# EAGLE schematic jb-main (EAGLE 4.15)

## Sheet 1 of 4
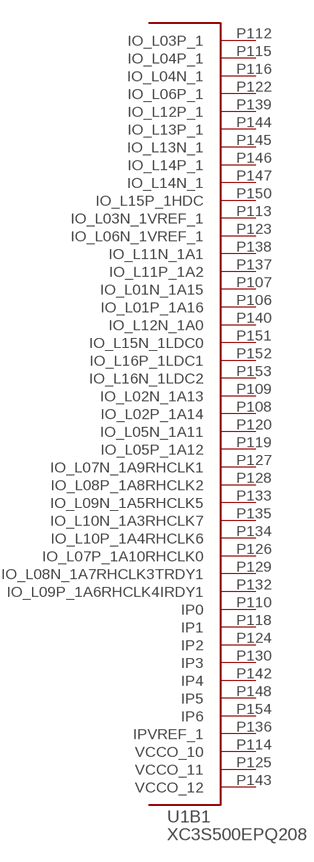
[diagram p0: schematic, sheet 1, part 1 of 2]
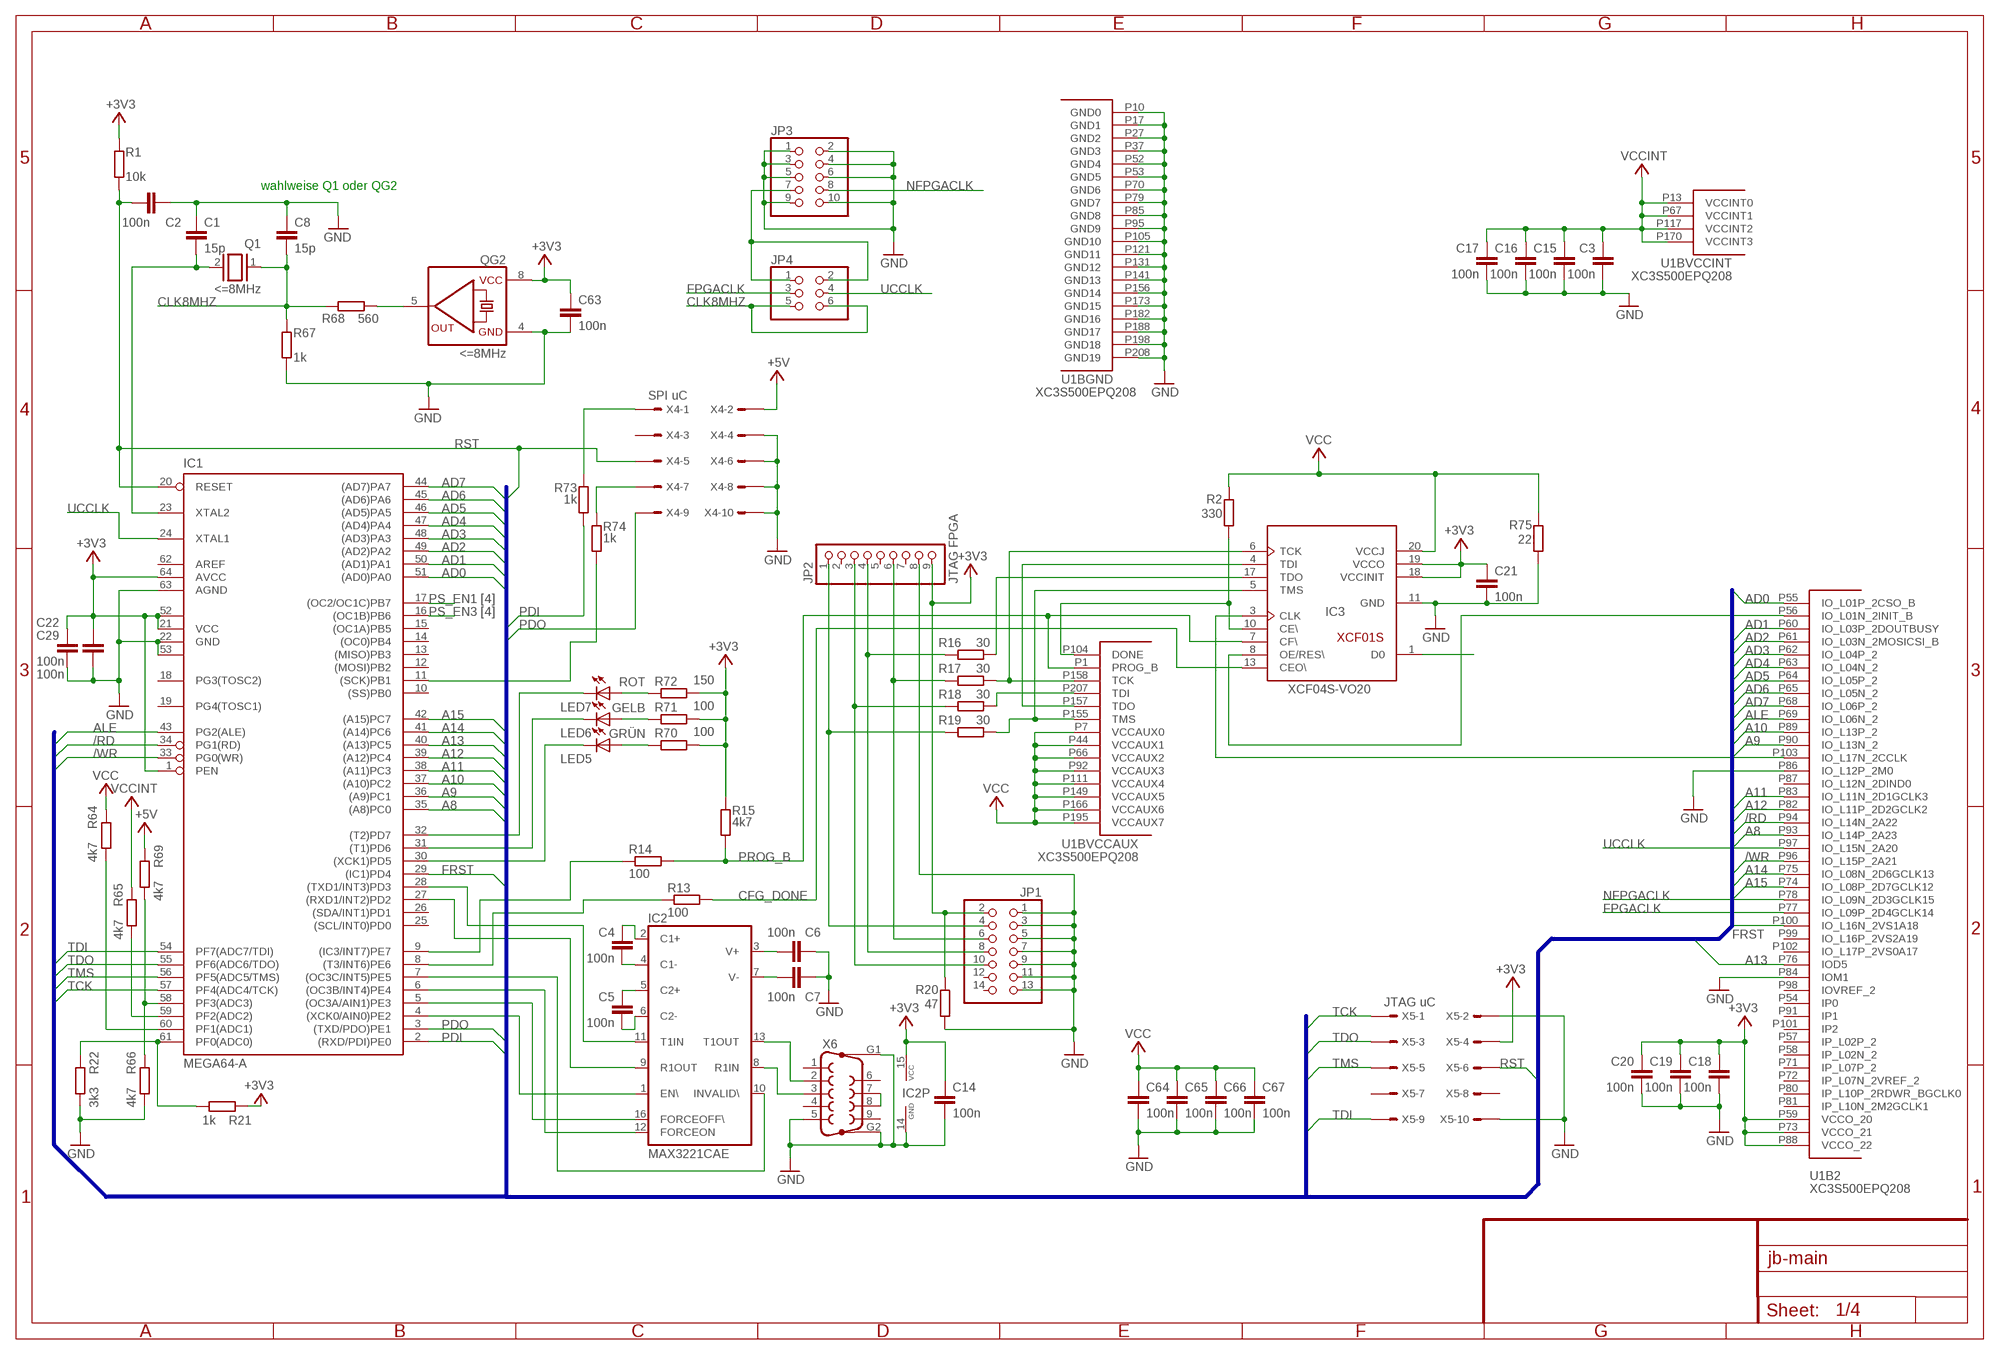
[diagram p1: schematic, sheet 1, part 2 of 2]

### Parts
C1  15p  C-EUC0805  [C0805]
C2  100n  C-EUC0805  [C0805]
C3  100n  C-EUC0805  [C0805]
C4  100n  C-EUC0805  [C0805]
C5  100n  C-EUC0805  [C0805]
C6  100n  C-EUC0805  [C0805]
C7  100n  C-EUC0805  [C0805]
C8  15p  C-EUC0805  [C0805]
C14  100n  C-EUC0805  [C0805]
C15  100n  C-EUC0805  [C0805]
C16  100n  C-EUC0805  [C0805]
C17  100n  C-EUC0805  [C0805]
C18  100n  C-EUC0805  [C0805]
C19  100n  C-EUC0805  [C0805]
C20  100n  C-EUC0805  [C0805]
C21  100n  C-EUC0805  [C0805]
C22  100n  C-EUC0805  [C0805]
C29  100n  C-EUC0805  [C0805]
C63  100n  C-EUC0805  [C0805]
C64  100n  C-EUC0805  [C0805]
C65  100n  C-EUC0805  [C0805]
C66  100n  C-EUC0805  [C0805]
C67  100n  C-EUC0805  [C0805]
IC1  MEGA64-A  [TQFP64]
IC2  MAX3221CAE  [SSOP16]
IC3  XCF04S-VO20  XCF01S-VO20  [VO20]
JP1  PINHD-2X7M  [2X07M]
JP2  JTAG FPGA  PINHD-1X9  [1X09]
JP3  PINHD-2X5  [2X05]
JP4  PINHD-2X3  [2X03]
LED5  GRÜN  LEDCHIPLED_1206  [CHIPLED_1206]
LED6  GELB  LEDCHIPLED_1206  [CHIPLED_1206]
LED7  ROT  LEDCHIPLED_1206  [CHIPLED_1206]
Q1  <=8MHz  XTAL/S  [QS]
QG2  <=8MHz  QG5460  [DIL08S]
R1  10k  R-EU_R0805  [R0805]
R2  330  R-EU_R0805  [R0805]
R13  100  R-EU_R0805  [R0805]
R14  100  R-EU_R0805  [R0805]
R15  4k7  R-EU_R0805  [R0805]
R16  30  R-EU_R0805  [R0805]
R17  30  R-EU_R0805  [R0805]
R18  30  R-EU_R0805  [R0805]
R19  30  R-EU_R0805  [R0805]
R20  47  R-EU_R0805  [R0805]
R21  1k  R-EU_R0805  [R0805]
R22  3k3  R-EU_R0805  [R0805]
R64  4k7  R-EU_R0805  [R0805]
R65  4k7  R-EU_R0805  [R0805]
R66  4k7  R-EU_R0805  [R0805]
R67  1k  R-EU_R0805  [R0805]
R68  560  R-EU_R0805  [R0805]
R69  4k7  R-EU_R0805  [R0805]
R70  100  R-EU_R0805  [R0805]
R71  100  R-EU_R0805  [R0805]
R72  150  R-EU_R0805  [R0805]
R73  1k  R-EU_R0805  [R0805]
R74  1k  R-EU_R0805  [R0805]
R75  22  R-EU_R0805  [R0805]
U1  XC3S500EPQ208  [PQ208]
X4  SPI uC  057-010-1  [057-010-1]
X5  JTAG uC  057-010-1  [057-010-1]
X6  F09HP  [F09HP]

### Nets
+3V3: C14.1 C18.1 C19.1 C20.1 C21.1 C22.1 C29.1 C63.1 IC1.1(PEN) IC1.21(VCC) IC1.52(VCC1) IC1.64(AVCC) IC2.15(VCC) IC3.18(VCCINIT) IC3.19(VCCO) JP1.2 JP2.9 QG2.8(VCC) R1.2 R15.2 R20.2 R21.2 R70.1 R71.1 R72.1 U1.P59(B2:VCCO_20) U1.P73(B2:VCCO_21) U1.P88(B2:VCCO_22) X5.4 ; also sheet 2,3,4
+5V: R69.2 X4.2 ; also sheet 2,3,4
/RD: IC1.34(PG1(RD)) U1.P94(B2:IO_L14N_2A22)
/WR: IC1.33(PG0(WR)) U1.P96(B2:IO_L15P_2A21)
A8: IC1.35((A8)PC0) U1.P93(B2:IO_L14P_2A23)
A9: IC1.36((A9)PC1) U1.P90(B2:IO_L13N_2)
A10: IC1.37((A10)PC2) U1.P89(B2:IO_L13P_2)
A11: IC1.38((A11)PC3) U1.P83(B2:IO_L11N_2D1GCLK3)
A12: IC1.39((A12)PC4) U1.P82(B2:IO_L11P_2D2GCLK2)
A13: IC1.40((A13)PC5) U1.P76(B2:IOD5)
A14: IC1.41((A14)PC6) U1.P75(B2:IO_L08N_2D6GCLK13)
A15: IC1.42((A15)PC7) U1.P74(B2:IO_L08P_2D7GCLK12)
AD0: IC1.51((AD0)PA0) U1.P55(B2:IO_L01P_2CSO_B)
AD1: IC1.50((AD1)PA1) U1.P60(B2:IO_L03P_2DOUTBUSY)
AD2: IC1.49((AD2)PA2) U1.P61(B2:IO_L03N_2MOSICSI_B)
AD3: IC1.48((AD3)PA3) U1.P62(B2:IO_L04P_2)
AD4: IC1.47((AD4)PA4) U1.P63(B2:IO_L04N_2)
AD5: IC1.46((AD5)PA5) U1.P64(B2:IO_L05P_2)
AD6: IC1.45((AD6)PA6) U1.P65(B2:IO_L05N_2)
AD7: IC1.44((AD7)PA7) U1.P68(B2:IO_L06P_2)
ALE: IC1.43(PG2(ALE)) U1.P69(B2:IO_L06N_2)
CFG_DONE: IC3.13(CEO\) R13.2
CLK8MHZ: C8.2 JP4.5 JP4.6 Q1.1 R67.2 R68.1
DONE: IC3.10(CE\) R2.1 U1.P104(BVCCAUX:DONE)
FPGACLK: JP4.3 U1.P77(B2:IO_L09P_2D4GCLK14)
FRST: IC1.29((IC1)PD4) U1.P100(B2:IO_L16N_2VS1A18)
GND: C1.1 C2.1 C3.2 C6.1 C7.1 C8.1 C14.2 C15.2 C16.2 C17.2 C18.2 C19.2 C20.2 C21.2 C22.2 C29.2 C63.2 C64.2 C65.2 C66.2 C67.2 IC1.22(GND) IC1.53(GND1) IC1.63(AGND) IC2.14(GND) IC3.11(GND) JP1.1 JP1.3 JP1.5 JP1.7 JP1.9 JP1.11 JP1.13 JP2.8 JP3.1 JP3.2 JP3.3 JP3.4 JP3.5 JP3.6 JP3.9 JP3.10 QG2.4(GND) R20.1 R22.1 R66.1 R67.1 R75.1 U1.P10(BGND:GND0) U1.P17(BGND:GND1) U1.P27(BGND:GND2) U1.P37(BGND:GND3) U1.P52(BGND:GND4) U1.P53(BGND:GND5) U1.P70(BGND:GND6) U1.P79(BGND:GND7) U1.P84(B2:IOM1) U1.P85(BGND:GND8) U1.P86(B2:IO_L12P_2M0) U1.P95(BGND:GND9) U1.P105(BGND:GND10) U1.P121(BGND:GND11) U1.P131(BGND:GND12) U1.P141(BGND:GND13) U1.P156(BGND:GND14) U1.P173(BGND:GND15) U1.P182(BGND:GND16) U1.P188(BGND:GND17) U1.P198(BGND:GND18) U1.P208(BGND:GND19) X4.4 X4.6 X4.8 X4.10 X5.2 X5.10 X6.5 X6.G1 X6.G2 ; also sheet 2,3,4
N$1: IC1.8((T3/INT6)PE6) R13.1
N$2: IC1.9((IC3/INT7)PE7) R14.1
N$3: X6.7 X6.8
N$4: IC3.6(TCK) R17.2 U1.P158(BVCCAUX:TCK)
N$5: JP1.6 JP2.6 R17.1
N$6: R18.2 U1.P207(BVCCAUX:TDI)
N$7: IC3.17(TDO) R16.2
N$9: IC3.5(TMS) R19.2 U1.P155(BVCCAUX:TMS)
N$10: JP1.8 JP2.4 R16.1
N$11: JP1.10 JP2.3 R18.1
N$12: JP1.4 JP2.1 R19.1
N$16: IC1.4((XCK0/AIN0)PE2) IC2.1(EN\)
N$17: IC1.5((OC3A/AIN1)PE3) IC2.16(FORCEOFF\)
N$18: IC1.6((OC3B/INT4)PE4) IC2.12(FORCEON)
N$19: IC1.7((OC3C/INT5)PE5) IC2.10(INVALID\)
N$20: C5.1 IC2.5(C2+)
N$21: C5.2 IC2.6(C2-)
N$22: C4.2 IC2.4(C1-)
N$23: C4.1 IC2.2(C1+)
N$24: IC3.4(TDI) U1.P157(BVCCAUX:TDO)
N$25: C6.2 IC2.3(V+)
N$26: C7.2 IC2.7(V-)
N$27: IC3.1(D0)
N$28: IC3.3(CLK) U1.P103(B2:IO_L17N_2CCLK)
N$29: IC3.8(OE/RES\) U1.P56(B2:IO_L01N_2INIT_B)
N$30: IC1.11((SCK)PB1) R74.1
N$44: IC1.61(PF0(ADC0)) R21.1 R22.2
N$135: R74.2 X4.7
N$136: R73.2 X4.1
N$143: JP3.7 JP4.1 JP4.2
N$145: IC1.59(PF2(ADC2)) R65.1
N$146: IC1.60(PF1(ADC1)) R64.1
N$147: IC1.58(PF3(ADC3)) R66.2 R69.1
N$148: QG2.5(OUT) R68.2
N$153: IC1.28((TXD1/INT3)PD3) IC2.11(T1IN)
N$154: IC1.27((RXD1/INT2)PD2) IC2.9(R1OUT)
N$164: LED5.A R70.2
N$182: LED6.A R71.2
N$183: LED7.A R72.2
N$184: IC1.30((XCK1)PD5) LED5.C
N$185: IC1.31((T1)PD6) LED6.C
N$186: IC1.32((T2)PD7) LED7.C
NFPGACLK: JP3.8 U1.P78(B2:IO_L09N_2D3GCLK15)
PDI: IC1.2((RXD/PDI)PE0) R73.1
PDO: IC1.3((TXD/PDO)PE1) X4.9
PROG_B: IC3.7(CF\) R14.2 R15.1 U1.P1(BVCCAUX:PROG_B)
PS_EN1: IC1.17((OC2/OC1C)PB7) ; also sheet 4
PS_EN3: IC1.16((OC1B)PB6) ; also sheet 4
RST: C2.2 IC1.20(RESET) R1.1 X4.5 X5.6
RXD: IC2.8(R1IN) X6.3
TCK: IC1.57(PF4(ADC4/TCK)) X5.1
TDI: IC1.54(PF7(ADC7/TDI)) X5.9
TDO: IC1.55(PF6(ADC6/TDO)) X5.3
TMS: IC1.56(PF5(ADC5/TMS)) X5.5
TXD: IC2.13(T1OUT) X6.2
UCCLK: IC1.24(XTAL1) JP4.4 U1.P97(B2:IO_L15N_2A20)
VCC: C64.1 C65.1 C66.1 C67.1 IC3.20(VCCJ) R2.2 R64.2 R75.2 U1.P7(BVCCAUX:VCCAUX0) U1.P44(BVCCAUX:VCCAUX1) U1.P66(BVCCAUX:VCCAUX2) U1.P92(BVCCAUX:VCCAUX3) U1.P111(BVCCAUX:VCCAUX4) U1.P149(BVCCAUX:VCCAUX5) U1.P166(BVCCAUX:VCCAUX6) U1.P195(BVCCAUX:VCCAUX7) ; also sheet 4
VCCINT: C3.1 C15.1 C16.1 C17.1 R65.2 U1.P13(BVCCINT:VCCINT0) U1.P67(BVCCINT:VCCINT1) U1.P117(BVCCINT:VCCINT2) U1.P170(BVCCINT:VCCINT3) ; also sheet 4
XTAL2: C1.2 IC1.23(XTAL2) Q1.2
Unconnected: IC1.10((SS)PB0) IC1.12((MOSI)PB2) IC1.13((MISO)PB3) IC1.14((OC0)PB4) IC1.15((OC1A)PB5) IC1.18(PG3(TOSC2)) IC1.19(PG4(TOSC1)) IC1.25((SCL/INT0)PD0) IC1.26((SDA/INT1)PD1) IC1.62(AREF) JP1.12 JP1.14 JP2.2 JP2.5 JP2.7 X4.3 X5.7 X5.8 X6.1 X6.4 X6.6 X6.9

### Buses
B$1

### Notes on the sheet
- wahlweise Q1 oder QG2
- [4]
- [4]

## Sheet 2 of 4
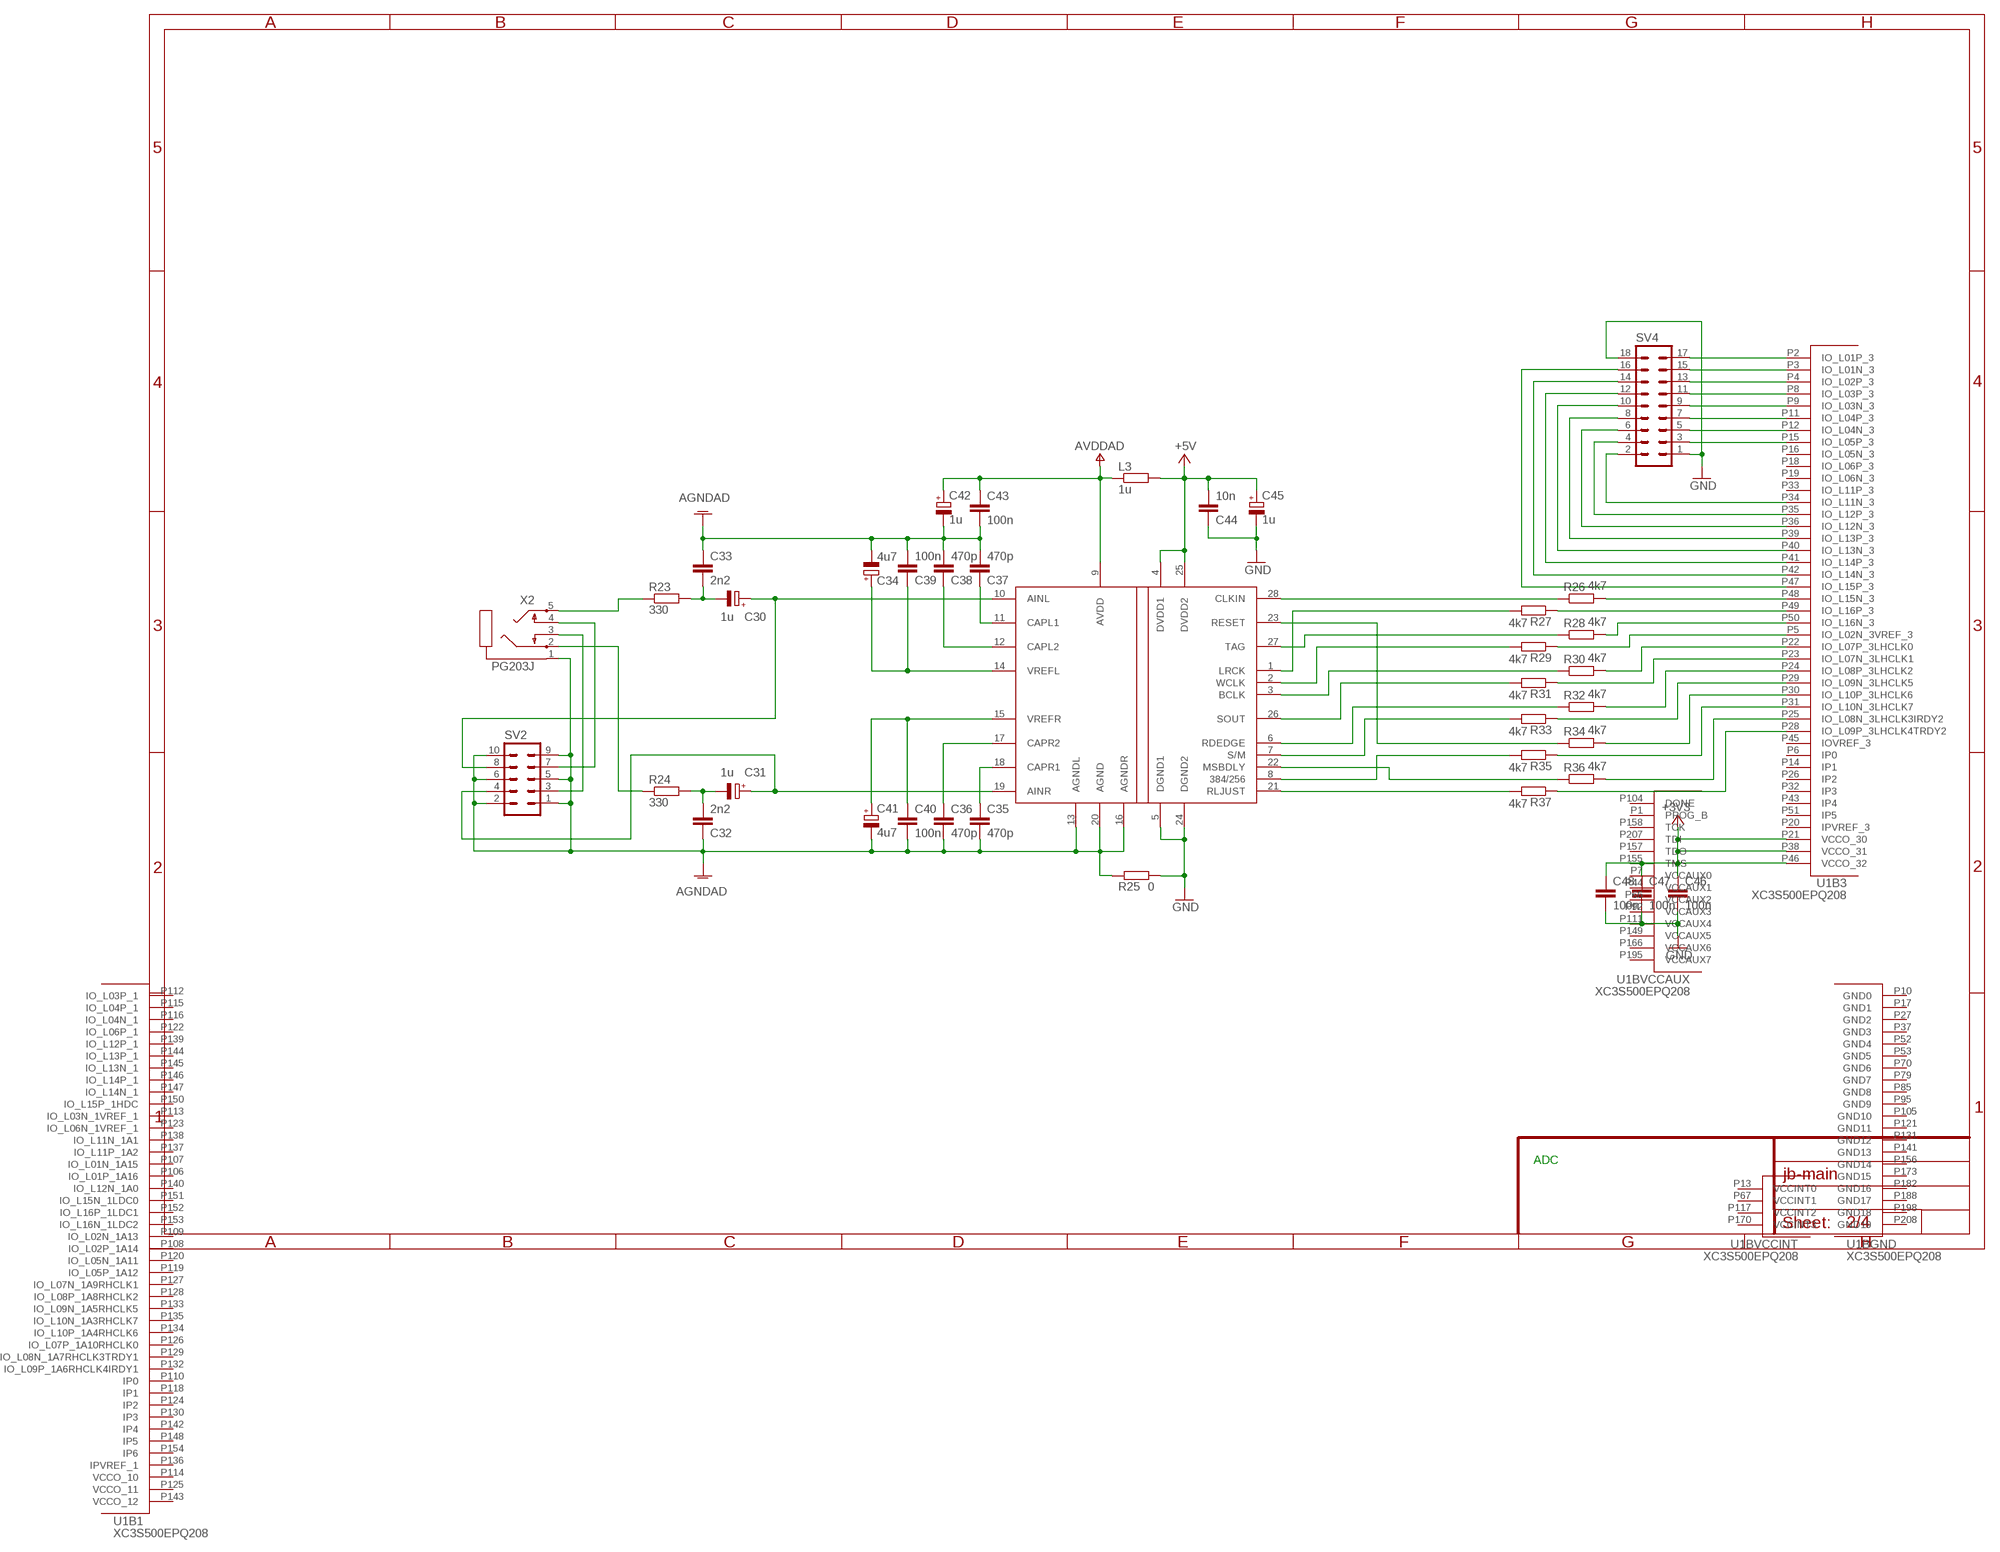
[diagram p2: schematic, sheet 2, part 1 of 2]
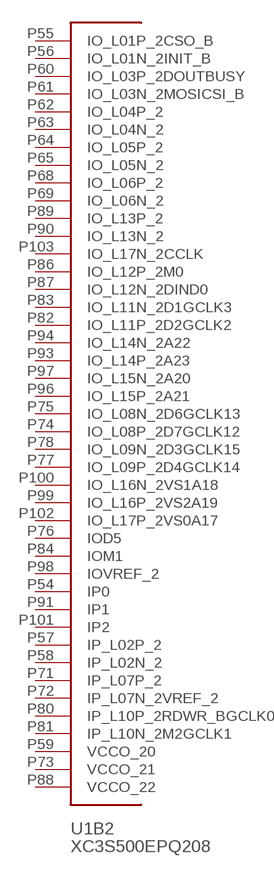
[diagram p3: schematic, sheet 2, part 2 of 2]

### Parts
C30  1u  CPOL-EUB/3528-21W  [B/3528-21W]
C31  1u  CPOL-EUB/3528-21W  [B/3528-21W]
C32  2n2  C-EUC0805  [C0805]
C33  2n2  C-EUC0805  [C0805]
C34  4u7  CPOL-EUC/6032-28R  [C/6032-28R]
C35  470p  C-EUC0805  [C0805]
C36  470p  C-EUC0805  [C0805]
C37  470p  C-EUC0805  [C0805]
C38  470p  C-EUC0805  [C0805]
C39  100n  C-EUC0805  [C0805]
C40  100n  C-EUC0805  [C0805]
C41  4u7  CPOL-EUC/6032-28R  [C/6032-28R]
C42  1u  CPOL-EUB/3528-21W  [B/3528-21W]
C43  100n  C-EUC0805  [C0805]
C44  10n  C-EUC0805  [C0805]
C45  1u  CPOL-EUB/3528-21W  [B/3528-21W]
C46  100n  C-EUC0805  [C0805]
C47  100n  C-EUC0805  [C0805]
C48  100n  C-EUC0805  [C0805]
IC5  AD1870SOL-28  [R-28]
L3  1u  R-EU_R0805  [R0805]
R23  330  R-EU_R0805  [R0805]
R24  330  R-EU_R0805  [R0805]
R25  0  R-EU_R0805  [R0805]
R26  4k7  R-EU_R0805  [R0805]
R27  4k7  R-EU_R0805  [R0805]
R28  4k7  R-EU_R0805  [R0805]
R29  4k7  R-EU_R0805  [R0805]
R30  4k7  R-EU_R0805  [R0805]
R31  4k7  R-EU_R0805  [R0805]
R32  4k7  R-EU_R0805  [R0805]
R33  4k7  R-EU_R0805  [R0805]
R34  4k7  R-EU_R0805  [R0805]
R35  4k7  R-EU_R0805  [R0805]
R36  4k7  R-EU_R0805  [R0805]
R37  4k7  R-EU_R0805  [R0805]
SV2  MA05-2  [MA05-2]
SV4  MA09-2  [MA09-2]
X2  PG203J  [PG203J]

### Nets
+3V3: C46.1 C47.1 C48.1 U1.P21(B3:VCCO_30) U1.P38(B3:VCCO_31) U1.P46(B3:VCCO_32) ; also sheet 1,3,4
+5V: C44.2 C45.+ IC5.4(DVDD1) IC5.25(DVDD2) L3.2 ; also sheet 1,3,4
AGNDAD: C32.1 C33.1 C34.- C35.2 C36.2 C37.2 C38.2 C39.2 C40.2 C41.- C42.- C43.2 IC5.13(AGNDL) IC5.16(AGNDR) IC5.20(AGND) R25.1 SV2.1 SV2.2 SV2.5 SV2.6 SV2.9 SV2.10 X2.1
AVDDAD: C42.+ C43.1 IC5.9(AVDD) L3.1
GND: C44.1 C45.- C46.2 C47.2 C48.2 IC5.5(DGND1) IC5.24(DGND2) R25.2 SV4.1 SV4.18 ; also sheet 1,3,4
N$42: C30.+ IC5.10(AINL) SV2.8
N$43: C31.+ IC5.19(AINR) SV2.4
N$45: C31.- C32.2 R24.2
N$46: C30.- C33.2 R23.2
N$47: R23.1 X2.5
N$48: R24.1 X2.2
N$49: C37.1 IC5.11(CAPL1)
N$50: SV2.3 X2.3
N$51: SV2.7 X2.4
N$52: C38.1 IC5.12(CAPL2)
N$53: C34.+ C39.1 IC5.14(VREFL)
N$54: C40.1 C41.+ IC5.15(VREFR)
N$55: C36.1 IC5.17(CAPR2)
N$56: C35.1 IC5.18(CAPR1)
N$57: IC5.26(SOUT) R31.2
N$58: IC5.3(BCLK) R30.1
N$59: IC5.28(CLKIN) R26.1
N$60: IC5.1(LRCK) R27.2
N$61: IC5.27(TAG) R28.1
N$62: IC5.2(WCLK) R29.2
N$63: IC5.23(RESET) R34.1
N$64: IC5.6(RDEDGE) R32.1
N$65: IC5.22(MSBDLY) R36.1
N$66: IC5.7(S/M) R33.2
N$67: IC5.8(384/256) R35.2
N$68: IC5.21(RLJUST) R37.2
N$69: R27.1 U1.P49(B3:IO_L16P_3)
N$70: R26.2 U1.P48(B3:IO_L15N_3)
N$71: R28.2 U1.P50(B3:IO_L16N_3)
N$72: R29.1 U1.P5(B3:IO_L02N_3VREF_3)
N$73: R30.2 U1.P22(B3:IO_L07P_3LHCLK0)
N$74: R31.1 U1.P23(B3:IO_L07N_3LHCLK1)
N$75: R32.2 U1.P24(B3:IO_L08P_3LHCLK2)
N$76: R33.1 U1.P29(B3:IO_L09N_3LHCLK5)
N$77: R34.2 U1.P30(B3:IO_L10P_3LHCLK6)
N$78: R35.1 U1.P31(B3:IO_L10N_3LHCLK7)
N$79: R36.2 U1.P25(B3:IO_L08N_3LHCLK3IRDY2)
N$80: R37.1 U1.P28(B3:IO_L09P_3LHCLK4TRDY2)
N$144: SV4.2 U1.P34(B3:IO_L11N_3)
N$149: SV4.4 U1.P35(B3:IO_L12P_3)
N$152: SV4.6 U1.P36(B3:IO_L12N_3)
N$155: SV4.8 U1.P39(B3:IO_L13P_3)
N$156: SV4.10 U1.P40(B3:IO_L13N_3)
N$157: SV4.12 U1.P41(B3:IO_L14P_3)
N$158: SV4.14 U1.P42(B3:IO_L14N_3)
N$159: SV4.16 U1.P47(B3:IO_L15P_3)
N$160: SV4.3 U1.P15(B3:IO_L05P_3)
N$161: SV4.5 U1.P12(B3:IO_L04N_3)
N$162: SV4.7 U1.P11(B3:IO_L04P_3)
N$163: SV4.9 U1.P9(B3:IO_L03N_3)
N$165: SV4.11 U1.P8(B3:IO_L03P_3)
N$166: SV4.13 U1.P4(B3:IO_L02P_3)
N$167: SV4.15 U1.P3(B3:IO_L01N_3)
N$168: SV4.17 U1.P2(B3:IO_L01P_3)
Unconnected: U1.P6(B3:IP0) U1.P14(B3:IP1) U1.P16(B3:IO_L05N_3) U1.P18(B3:IO_L06P_3) U1.P19(B3:IO_L06N_3) U1.P20(B3:IPVREF_3) U1.P26(B3:IP2) U1.P32(B3:IP3) U1.P33(B3:IO_L11P_3) U1.P43(B3:IP4) U1.P45(B3:IOVREF_3) U1.P51(B3:IP5)

### Notes on the sheet
- ADC

## Sheet 3 of 4
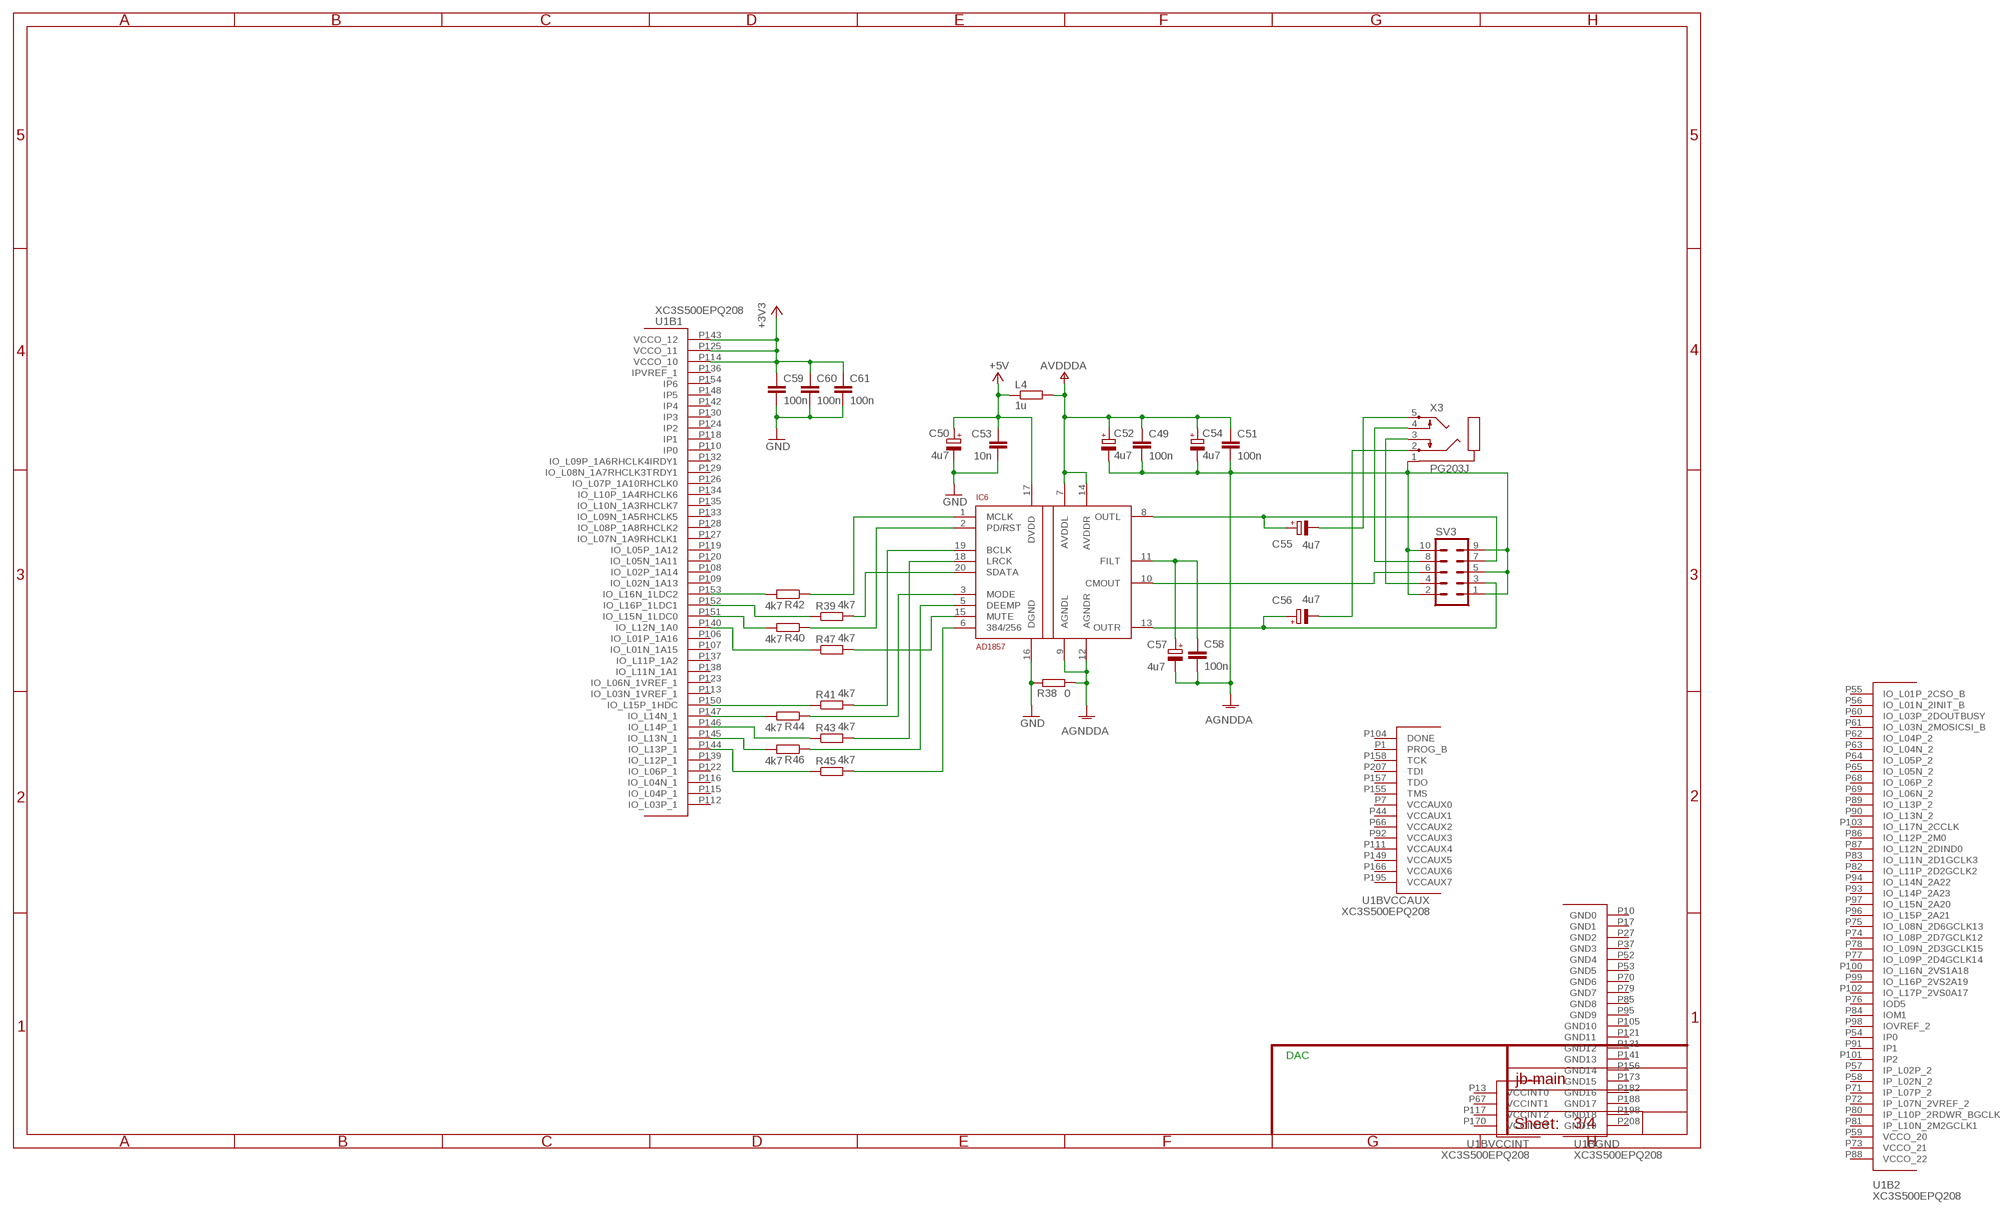
[diagram p4: schematic, sheet 3]

### Parts
C49  100n  C-EUC0805  [C0805]
C50  4u7  CPOL-EUC/6032-28R  [C/6032-28R]
C51  100n  C-EUC0805  [C0805]
C52  4u7  CPOL-EUC/6032-28R  [C/6032-28R]
C53  10n  C-EUC0805  [C0805]
C54  4u7  CPOL-EUC/6032-28R  [C/6032-28R]
C55  4u7  CPOL-EUC/6032-28R  [C/6032-28R]
C56  4u7  CPOL-EUC/6032-28R  [C/6032-28R]
C57  4u7  CPOL-EUC/6032-28R  [C/6032-28R]
C58  100n  C-EUC0805  [C0805]
C59  100n  C-EUC0805  [C0805]
C60  100n  C-EUC0805  [C0805]
C61  100n  C-EUC0805  [C0805]
IC6  AD1857  AD1857_5820-SSOP  [RS-20]
L4  1u  R-EU_R0805  [R0805]
R38  0  R-EU_R0805  [R0805]
R39  4k7  R-EU_R0805  [R0805]
R40  4k7  R-EU_R0805  [R0805]
R41  4k7  R-EU_R0805  [R0805]
R42  4k7  R-EU_R0805  [R0805]
R43  4k7  R-EU_R0805  [R0805]
R44  4k7  R-EU_R0805  [R0805]
R45  4k7  R-EU_R0805  [R0805]
R46  4k7  R-EU_R0805  [R0805]
R47  4k7  R-EU_R0805  [R0805]
SV3  MA05-2  [MA05-2]
X3  PG203J  [PG203J]

### Nets
+3V3: C59.1 C60.1 C61.1 U1.P114(B1:VCCO_10) U1.P125(B1:VCCO_11) U1.P143(B1:VCCO_12) ; also sheet 1,2,4
+5V: C50.+ C53.1 IC6.17(DVDD) L4.1 ; also sheet 1,2,4
AGND: IC6.9(AGNDL) IC6.12(AGNDR) R38.2 ; supply symbol labelled AGNDDA
AGNDDA: C49.2 C51.2 C52.- C54.- C57.- C58.2 SV3.1 SV3.2 SV3.5 SV3.9 SV3.10 X3.1
AVDDDA: C49.1 C51.1 C52.+ C54.+ IC6.7(AVDDL) IC6.14(AVDDR) L4.2
GND: C50.- C53.2 C59.2 C60.2 C61.2 IC6.16(DGND) R38.1 ; also sheet 1,2,4
N$82: C55.+ IC6.8(OUTL) SV3.7
N$83: C56.+ IC6.13(OUTR) SV3.3
N$84: SV3.8 X3.4
N$85: SV3.4 X3.3
N$86: IC6.10(CMOUT) SV3.6
N$87: C55.- X3.5
N$88: C56.- X3.2
N$89: R42.2 U1.P153(B1:IO_L16N_1LDC2)
N$90: C57.+ C58.1 IC6.11(FILT)
N$91: IC6.1(MCLK) R42.1
N$92: R39.1 U1.P152(B1:IO_L16P_1LDC1)
N$93: IC6.20(SDATA) R39.2
N$94: R40.2 U1.P151(B1:IO_L15N_1LDC0)
N$95: IC6.2(PD/RST) R40.1
N$96: R41.1 U1.P150(B1:IO_L15P_1HDC)
N$97: IC6.19(BCLK) R41.2
N$98: R44.2 U1.P147(B1:IO_L14N_1)
N$99: IC6.3(MODE) R44.1
N$100: R43.1 U1.P146(B1:IO_L14P_1)
N$101: IC6.18(LRCK) R43.2
N$102: R46.2 U1.P145(B1:IO_L13N_1)
N$103: IC6.5(DEEMP) R46.1
N$104: R45.1 U1.P144(B1:IO_L13P_1)
N$105: IC6.6(384/256) R45.2
N$106: R47.1 U1.P140(B1:IO_L12N_1A0)
N$107: IC6.15(MUTE) R47.2

### Notes on the sheet
- DAC

## Sheet 4 of 4
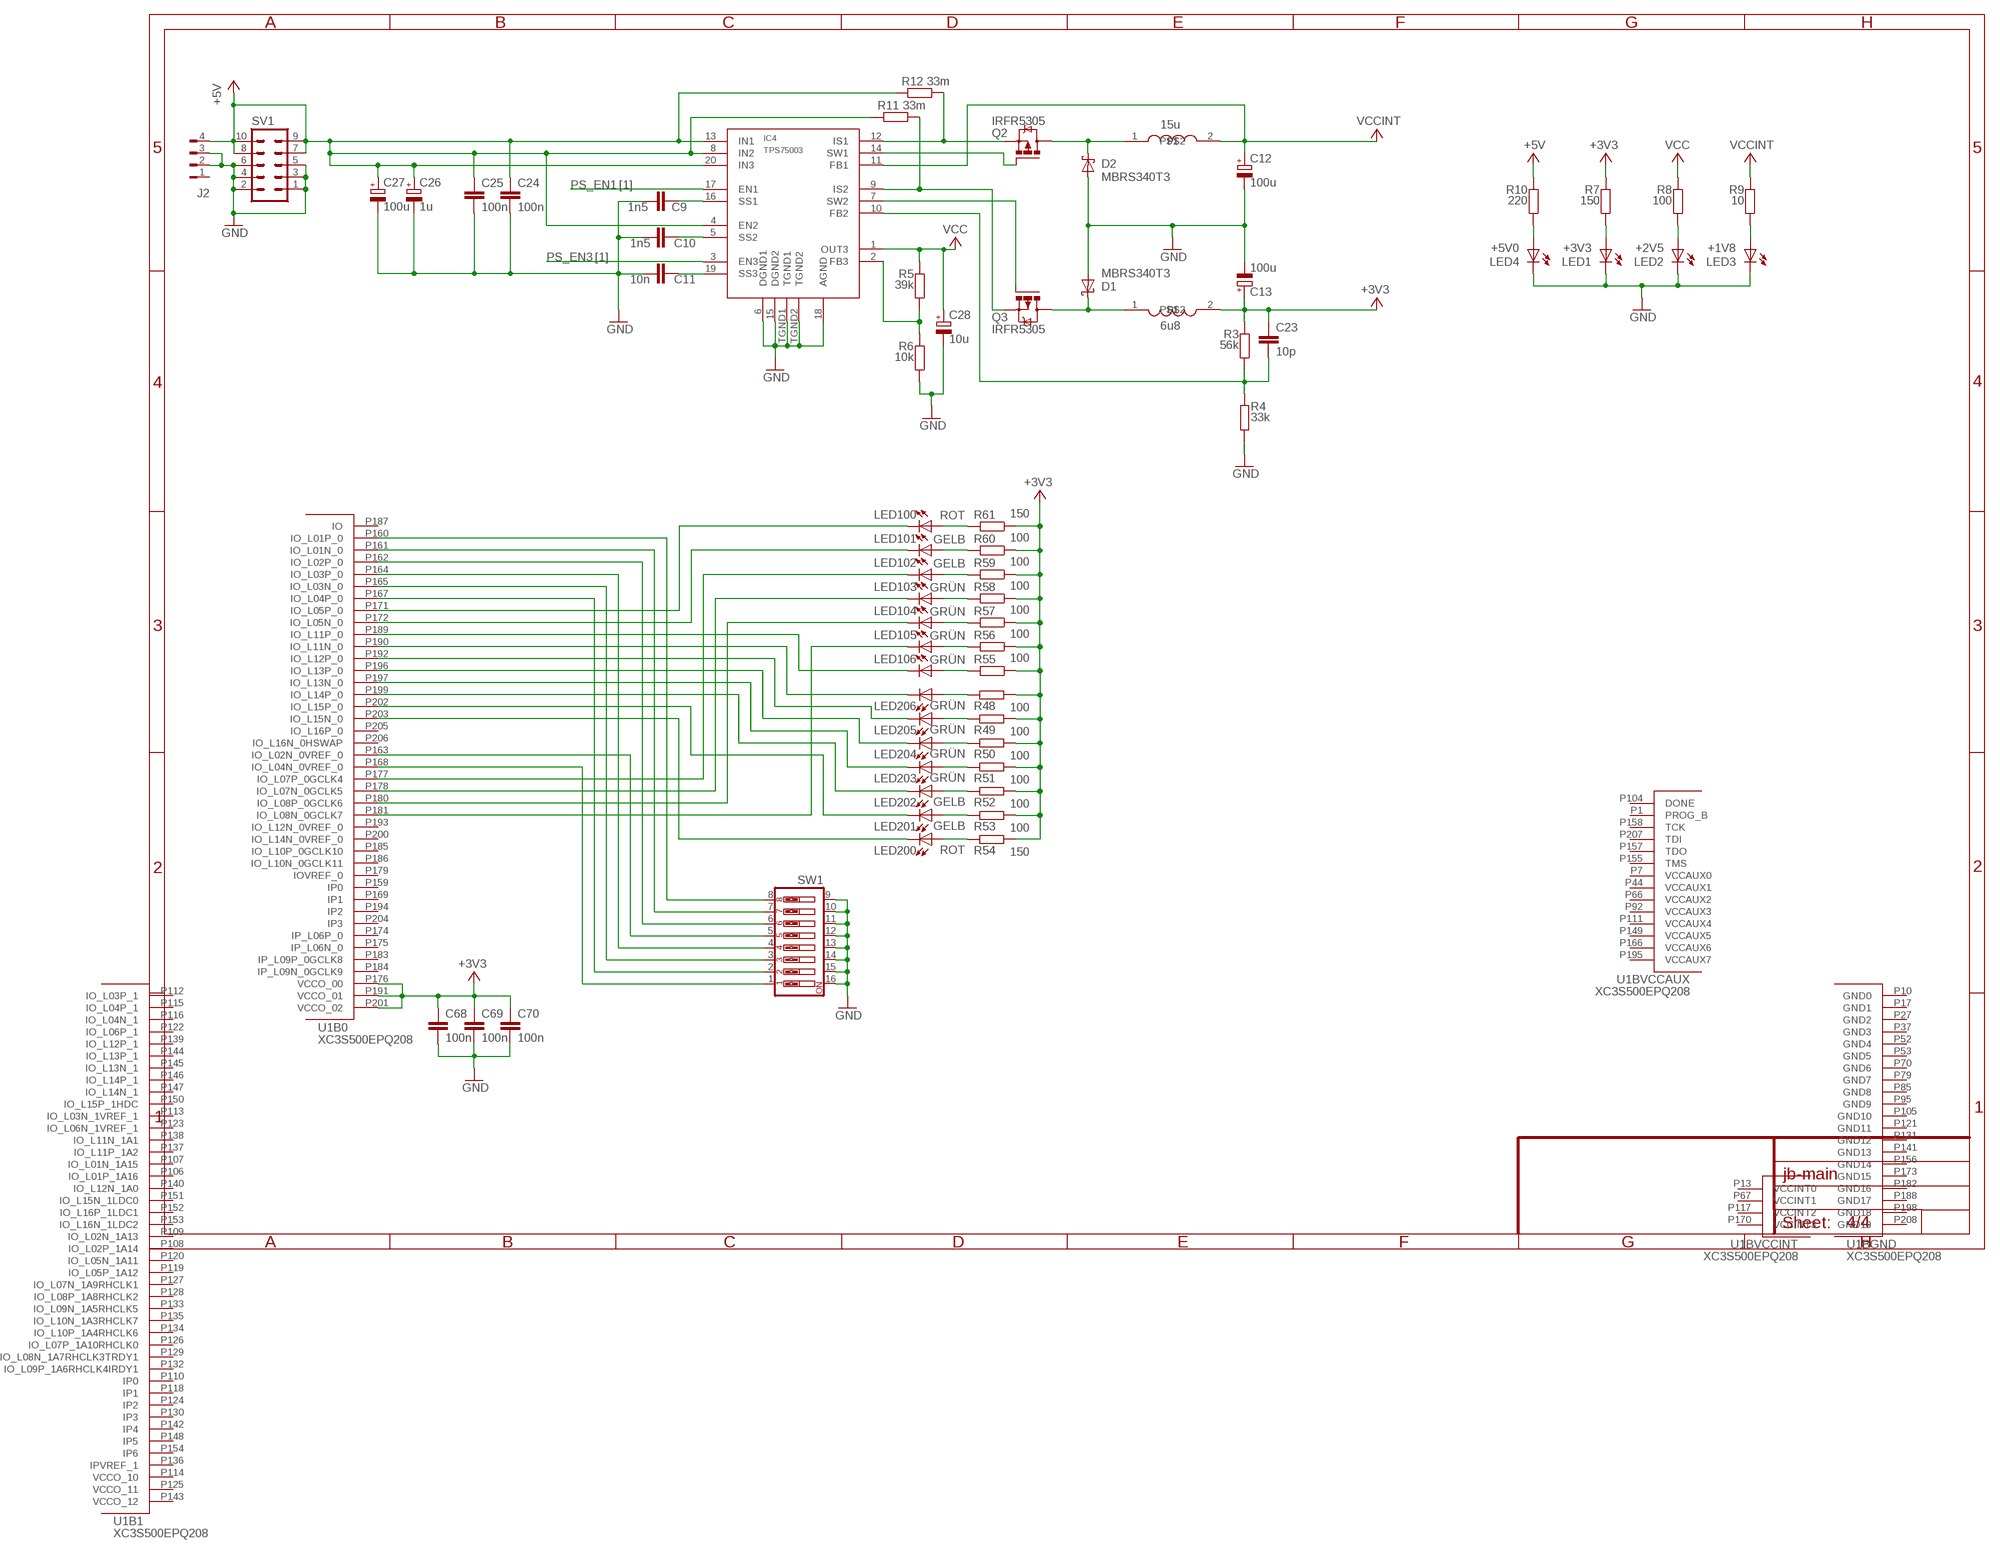
[diagram p5: schematic, sheet 4, part 1 of 2]
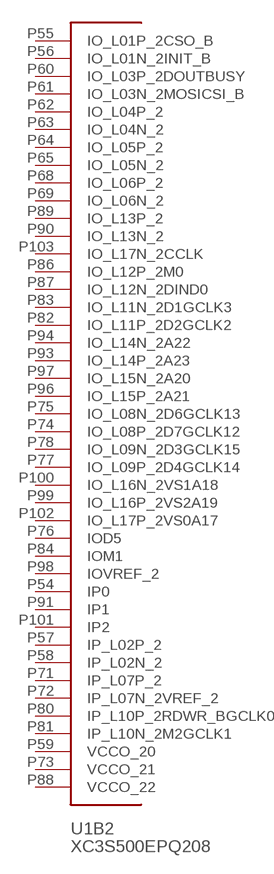
[diagram p6: schematic, sheet 4, part 2 of 2]

### Parts
C9  1n5  C-EUC0805  [C0805]
C10  1n5  C-EUC0805  [C0805]
C11  10n  C-EUC0805  [C0805]
C12  100u  CPOL-EUD/7343-31W  [D/7343-31W]
C13  100u  CPOL-EUD/7343-31W  [D/7343-31W]
C23  10p  C-EUC0805  [C0805]
C24  100n  C-EUC0805  [C0805]
C25  100n  C-EUC0805  [C0805]
C26  1u  CPOL-EUB/3528-21W  [B/3528-21W]
C27  100u  CPOL-EUD/7343-31W  [D/7343-31W]
C28  10u  CPOL-EUD/7343-31W  [D/7343-31W]
C68  100n  C-EUC0805  [C0805]
C69  100n  C-EUC0805  [C0805]
C70  100n  C-EUC0805  [C0805]
D1  MBRS340T3  SCHOTTKY-DIODESMC  [SMC]
D2  MBRS340T3  SCHOTTKY-DIODESMC  [SMC]
IC4  TPS75003  [R-PQFP-20]
J2  FLOP-4W827001  [827001]
L1  15u  L-13X10  [L-13X10]
L2  L-13X10  [L-13X10]
LED1  +3V3  LEDCHIPLED_1206  [CHIPLED_1206]
LED2  +2V5  LEDCHIPLED_1206  [CHIPLED_1206]
LED3  +1V8  LEDCHIPLED_1206  [CHIPLED_1206]
LED4  +5V0  LEDCHIPLED_1206  [CHIPLED_1206]
LED100  ROT  LEDCHIPLED_1206  [CHIPLED_1206]
LED101  GELB  LEDCHIPLED_1206  [CHIPLED_1206]
LED102  GELB  LEDCHIPLED_1206  [CHIPLED_1206]
LED103  GRÜN  LEDCHIPLED_1206  [CHIPLED_1206]
LED104  GRÜN  LEDCHIPLED_1206  [CHIPLED_1206]
LED105  GRÜN  LEDCHIPLED_1206  [CHIPLED_1206]
LED106  GRÜN  LEDCHIPLED_1206  [CHIPLED_1206]
LED200  ROT  LEDCHIPLED_1206  [CHIPLED_1206]
LED201  GELB  LEDCHIPLED_1206  [CHIPLED_1206]
LED202  GELB  LEDCHIPLED_1206  [CHIPLED_1206]
LED203  GRÜN  LEDCHIPLED_1206  [CHIPLED_1206]
LED204  GRÜN  LEDCHIPLED_1206  [CHIPLED_1206]
LED205  GRÜN  LEDCHIPLED_1206  [CHIPLED_1206]
LED206  GRÜN  LEDCHIPLED_1206  [CHIPLED_1206]
Q2  IRFR5305  [D2PACK]
Q3  IRFR5305  [D2PACK]
R3  56k  R-EU_R0805  [R0805]
R4  33k  R-EU_R0805  [R0805]
R5  39k  R-EU_R0805  [R0805]
R6  10k  R-EU_R0805  [R0805]
R7  150  R-EU_R0805  [R0805]
R8  100  R-EU_R0805  [R0805]
R9  10  R-EU_R0805  [R0805]
R10  220  R-EU_R0805  [R0805]
R11  33m  R-EU_0204/7  [0204/7]
R12  33m  R-EU_0204/7  [0204/7]
R48  100  R-EU_R0805  [R0805]
R49  100  R-EU_R0805  [R0805]
R50  100  R-EU_R0805  [R0805]
R51  100  R-EU_R0805  [R0805]
R52  100  R-EU_R0805  [R0805]
R53  100  R-EU_R0805  [R0805]
R54  150  R-EU_R0805  [R0805]
R55  100  R-EU_R0805  [R0805]
R56  100  R-EU_R0805  [R0805]
R57  100  R-EU_R0805  [R0805]
R58  100  R-EU_R0805  [R0805]
R59  100  R-EU_R0805  [R0805]
R60  100  R-EU_R0805  [R0805]
R61  150  R-EU_R0805  [R0805]
SV1  MA05-2  [MA05-2]
SW1  SW_DIP-8  [EDG-08]

### Nets
+3V3: C13.+ C23.1 C68.1 C69.1 C70.1 L2.2 R3.2 R7.2 R48.1 R49.1 R50.1 R51.1 R52.1 R53.1 R54.1 R55.1 R56.1 R57.1 R58.1 R59.1 R60.1 R61.1 U1.P176(B0:VCCO_00) U1.P191(B0:VCCO_01) U1.P201(B0:VCCO_02) ; also sheet 1,2,3
+5V: C24.1 C25.1 C26.+ C27.+ IC4.4(EN2) IC4.8(IN2) IC4.13(IN1) IC4.20(IN3) J2.4 R10.2 R11.2 R12.2 SV1.7 SV1.8 SV1.9 SV1.10 ; also sheet 1,2,3
GND: C9.1 C10.1 C11.1 C12.- C13.- C24.2 C25.2 C26.- C27.- C28.- C68.2 C69.2 C70.2 D1.A D2.A IC4.6(DGND1) IC4.15(DGND2) IC4.18(AGND) IC4.TGND1 IC4.TGND2 J2.2 J2.3 LED1.C LED2.C LED3.C LED4.C R4.1 R6.1 SV1.1 SV1.2 SV1.3 SV1.4 SV1.5 SV1.6 SW1.9 SW1.10 SW1.11 SW1.12 SW1.13 SW1.14 SW1.15 SW1.16 ; also sheet 1,2,3
N$8: C9.2 IC4.16(SS1)
N$13: C10.2 IC4.5(SS2)
N$14: C11.2 IC4.19(SS3)
N$15: D1.C L2.1 Q3.2(D)
N$31: D2.C L1.1 Q2.2(D)
N$32: IC4.2(FB3) R5.1 R6.2
N$33: LED4.A R10.1
N$34: IC4.14(SW1) Q2.1(G)
N$35: IC4.7(SW2) Q3.1(G)
N$36: IC4.9(IS2) Q3.3(S) R11.1
N$37: IC4.12(IS1) Q2.3(S) R12.1
N$38: C23.2 IC4.10(FB2) R3.1 R4.2
N$39: LED1.A R7.1
N$40: LED2.A R8.1
N$41: LED3.A R9.1
N$81: LED206.C U1.P190(B0:IO_L11N_0)
N$108: LED206.A R48.2
N$109: LED205.A R49.2
N$110: LED204.A R50.2
N$111: LED203.A R51.2
N$112: LED202.A R52.2
N$113: LED201.A R53.2
N$114: LED200.A R54.2
N$115: LED106.C U1.P189(B0:IO_L11P_0)
N$116: LED105.C U1.P181(B0:IO_L08N_0GCLK7)
N$117: LED106.A R55.2
N$118: LED105.A R56.2
N$119: LED104.A R57.2
N$120: LED103.A R58.2
N$121: LED102.A R59.2
N$122: LED101.A R60.2
N$123: LED100.A R61.2
N$124: LED104.C U1.P180(B0:IO_L08P_0GCLK6)
N$125: LED103.C U1.P178(B0:IO_L07N_0GCLK5)
N$126: LED102.C U1.P177(B0:IO_L07P_0GCLK4)
N$127: LED101.C U1.P172(B0:IO_L05N_0)
N$128: LED100.C U1.P171(B0:IO_L05P_0)
N$129: LED205.C U1.P192(B0:IO_L12P_0)
N$130: LED204.C U1.P196(B0:IO_L13P_0)
N$131: LED203.C U1.P197(B0:IO_L13N_0)
N$132: LED202.C U1.P199(B0:IO_L14P_0)
N$133: LED201.C U1.P202(B0:IO_L15P_0)
N$134: LED200.C U1.P203(B0:IO_L15N_0)
N$137: SW1.6 U1.P162(B0:IO_L02P_0)
N$138: SW1.5 U1.P163(B0:IO_L02N_0VREF_0)
N$139: SW1.4 U1.P164(B0:IO_L03P_0)
N$140: SW1.3 U1.P165(B0:IO_L03N_0)
N$141: SW1.2 U1.P167(B0:IO_L04P_0)
N$142: SW1.1 U1.P168(B0:IO_L04N_0VREF_0)
N$150: SW1.7 U1.P161(B0:IO_L01N_0)
N$151: SW1.8 U1.P160(B0:IO_L01P_0)
PS_EN1: IC4.17(EN1) ; also sheet 1
PS_EN3: IC4.3(EN3) ; also sheet 1
VCC: C28.+ IC4.1(OUT3) R5.2 R8.2 ; also sheet 1
VCCINT: C12.+ IC4.11(FB1) L1.2 R9.2 ; also sheet 1
Unconnected: J2.1 U1.P54(B2:IP0) U1.P57(B2:IP_L02P_2) U1.P58(B2:IP_L02N_2) U1.P71(B2:IP_L07P_2) U1.P72(B2:IP_L07N_2VREF_2) U1.P80(B2:IP_L10P_2RDWR_BGCLK0) U1.P81(B2:IP_L10N_2M2GCLK1) U1.P87(B2:IO_L12N_2DIND0) U1.P91(B2:IP1) U1.P98(B2:IOVREF_2) U1.P99(B2:IO_L16P_2VS2A19) U1.P101(B2:IP2) U1.P102(B2:IO_L17P_2VS0A17) U1.P106(B1:IO_L01P_1A16) U1.P107(B1:IO_L01N_1A15) U1.P108(B1:IO_L02P_1A14) U1.P109(B1:IO_L02N_1A13) U1.P110(B1:IP0) U1.P112(B1:IO_L03P_1) U1.P113(B1:IO_L03N_1VREF_1) U1.P115(B1:IO_L04P_1) U1.P116(B1:IO_L04N_1) U1.P118(B1:IP1) U1.P119(B1:IO_L05P_1A12) U1.P120(B1:IO_L05N_1A11) U1.P122(B1:IO_L06P_1) U1.P123(B1:IO_L06N_1VREF_1) U1.P124(B1:IP2) U1.P126(B1:IO_L07P_1A10RHCLK0) U1.P127(B1:IO_L07N_1A9RHCLK1) U1.P128(B1:IO_L08P_1A8RHCLK2) U1.P129(B1:IO_L08N_1A7RHCLK3TRDY1) U1.P130(B1:IP3) U1.P132(B1:IO_L09P_1A6RHCLK4IRDY1) U1.P133(B1:IO_L09N_1A5RHCLK5) U1.P134(B1:IO_L10P_1A4RHCLK6) U1.P135(B1:IO_L10N_1A3RHCLK7) U1.P136(B1:IPVREF_1) U1.P137(B1:IO_L11P_1A2) U1.P138(B1:IO_L11N_1A1) U1.P139(B1:IO_L12P_1) U1.P142(B1:IP4) U1.P148(B1:IP5) U1.P154(B1:IP6) U1.P159(B0:IP0) U1.P169(B0:IP1) U1.P174(B0:IP_L06P_0) U1.P175(B0:IP_L06N_0) U1.P179(B0:IOVREF_0) U1.P183(B0:IP_L09P_0GCLK8) U1.P184(B0:IP_L09N_0GCLK9) U1.P185(B0:IO_L10P_0GCLK10) U1.P186(B0:IO_L10N_0GCLK11) U1.P187(B0:IO) U1.P193(B0:IO_L12N_0VREF_0) U1.P194(B0:IP2) U1.P200(B0:IO_L14N_0VREF_0) U1.P204(B0:IP3) U1.P205(B0:IO_L16P_0) U1.P206(B0:IO_L16N_0HSWAP)

### Notes on the sheet
- 15u
- [1]
- [1]
- 6u8

## Library data of the parts
C1-C11 C14-C25 C29 C32 C33 C35-C40 C43 C44 C46-C49 C51 C53 C58-C61 C63-C70 = rcl:C-EU: CAPACITOR, European symbol
C12 C13 C26-C28 C30 C31 C34 C41 C42 C45 C50 C52 C54-C57 = rcl:CPOL-EU: POLARIZED CAPACITOR, European symbol
D1 D2 = diode:SCHOTTKY-DIODE: Schottky Diode
IC1 = avr:MEGA64: MICROCONTROLLER 64 Kbytes FLASH 4 Kbytes SRAM 2 Kbytes EEPROM DUAL USART 8-channel 10 bit ADC
IC2 = maxim-9:MAX3221*: RS-232 Transceivers with AutoShutdown 1µA Supply-Current, True +3V to +5.5V http://dbserv.maxim-ic.com/
IC3 = xilinx_virtexii-xc2v80&flashprom:XCF01S-VO20: Flash Prom with 1MBit Schinko / Baier
IC4 = jukebox:TPS75003
IC5 = jukebox:AD1870
IC6 = jukebox:AD1857_58
J2 = my-con-amp:FLOP-4W: MATE N-LOCK Floppy / HDD conector Distributor: Bürklin 71F972
JP1 = pinhead:PINHD-2X7: PIN HEADER
JP2 = pinhead:PINHD-1X9: PIN HEADER
JP3 = pinhead:PINHD-2X5: PIN HEADER
JP4 = pinhead:PINHD-2X3: PIN HEADER
L1 L2 = jukebox:L-13X10
L3 L4 R1-R61 R64-R75 = rcl:R-EU_: RESISTOR, European symbol
LED1-LED7 LED100-LED106 LED200-LED206 = led:LED: LED OSRAM: - CHIPLED LG R971, LG N971, LY N971, LG Q971, LY Q971, LO R971, LY R971 LH N974, LH R974 LS Q976, LO Q976, LY Q976 LO Q996 - Hyper CHIPLED LW Q18S LB Q993, LB Q99A, LB R99A - SideLED LS A670, LO A670, LY A670, LG A670, LP A670 LB A673, LV A673, LT A673, LW A673 LH A674 LY A675 LS A676, LA A676, LO A676, LY A676, LW A676 LS A679, LY A679, LG A679 - Hyper Micro SIDELED® LS Y876, LA Y876, LO Y876, LY Y876 LT Y87S - SmartLED LW L88C, LW L88S LB L89C, LB L89S, LG L890 LS L89K, LO L89K, LY L89K LS L896, LA L896, LO L896, LY L896 - TOPLED LS T670, LO T670, LY T670, LG T670, LP T670 LSG T670, LSP T670, LSY T670, LOP T670, LYG T670 LG T671, LOG T671, LSG T671 LB T673, LV T673, LT T673, LW T673 LH T674 LS T676, LA T676, LO T676, LY T676, LB T676, LH T676, LSB T676, LW T676 LB T67C, LV T67C, LT T67C, LS T67K, LO T67K, LY T67K, LW E67C LS E67B, LA E67B, LO E67B, LY E67B, LB E67C, LV E67C, LT E67C LW T67C LS T679, LY T679, LG T679 LS T770, LO T770, LY T770, LG T770, LP T770 LB T773, LV T773, LT T773, LW T773 LH T774 LS E675, LA E675, LY E675, LS T675 LS T776, LA T776, LO T776, LY T776, LB T776 LHGB T686 LT T68C, LB T68C - Hyper Mini TOPLED® LB M676 - Mini TOPLED Santana® LG M470 LS M47K, LO M47K, LY M47K Source: http://www.osram.convergy.de/
Q1 = special:XTAL/S: CRYSTAL
Q2 Q3 = transistor-power:IRF?5305: HEXFET Power MOSFET
QG2 = crystal:QG5460: CRYSTAL RESONATOR
SV1-SV3 = con-lstb:MA05-2: PIN HEADER
SV4 = con-lstb:MA09-2: PIN HEADER
SW1 = special:SW_DIP-8: DIP SWITCH
U1 = xilinx_spartan3_virtex4_and_5:XC3S500EPQ208: Xilinx FPGA
X2 X3 = con-hirschmann:PG203J: MIC/HEADPHONE JACK KS-S stereo microphone/headphone jack PG203JN (Schukat)
X4 X5 = con-panduit:057-010-: CONNECTOR 10-pin series 057 contact pc board low profile headers
X6 = con-subd:F09HP: SUB-D